# Altium schematic sheet BAT POWER.SchDoc
size A4
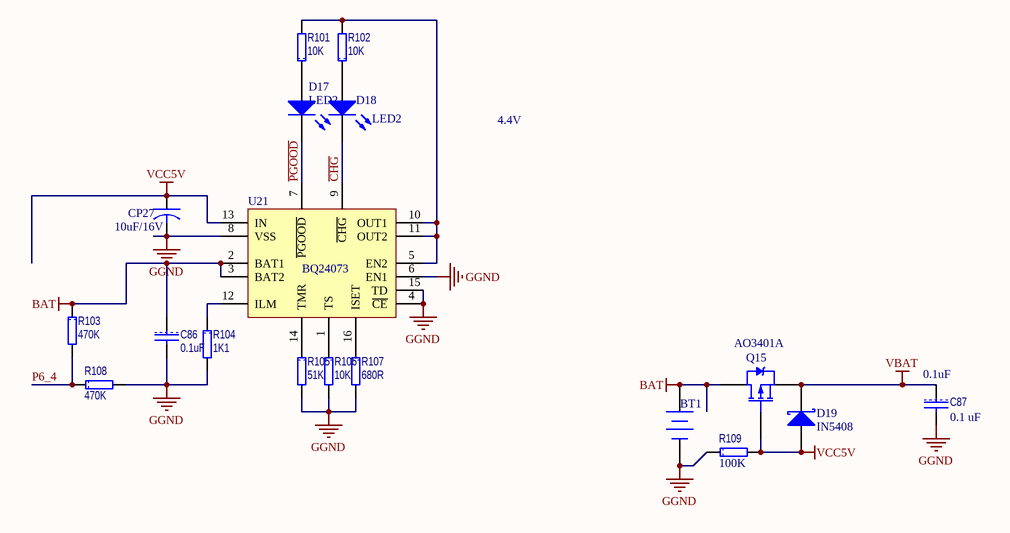
[diagram p0: BAT POWER.SchDoc]

## Parts
BT1  Battery  [BAT-2]  (value not drawn)
C86  0.1uF  [1608[0603]]
C87  value 0.1uF  电容: 0.1 uF  [1608[0603]C]  (hidden comment: C1608X7R1H104K)
CP27  10uF/16V  [3216[1206]]
D17  LED2  [0805LED]
D18  LED2  [0805LED]
D19  IN5408  [DO-214AB/SMC]
Q15  AO3401A  [SOT23_N]
R101  10K  [1608[0603]R]
R102  10K  [1608[0603]R]
R103  470K  [1608[0603]R]
R104  1K1  [1608[0603]R]
R105  51K  [1608[0603]R]
R106  10K  [1608[0603]R]
R107  680R  [1608[0603]R]
R108  470K  [1608[0603]R]
R109  value 100K  [1608[0603]R]  (hidden comment: CRCW0603100KFKEA)
U21  BQ24073  [BQ24073]

## Nets
BAT: BT1.1(+) C86.1 Q15.3(D) R103.1 U21.2(BAT1) U21.3(BAT2)
GGND: BT1.2(-) C86.2 C87.2 CP27.2 R104.2 R105.2 R106.2 R107.2 R108.2 R109.1 U21.4(~{CE}) U21.6(EN1) U21.8(VSS) U21.15(TD)
VBAT: C87.1 D19.2(K) Q15.2(S)
VCC5V: CP27.1 D19.1(A) Q15.1(G) R109.2 U21.13(IN)
~{CHG}: D18.2(K) U21.9(~{CHG})
P6_4: R103.2 R108.1
~{PGOOD}: D17.2(K) U21.7(~{PGOOD})
NetD17_1: D17.1(A) R101.1
NetD18_1: D18.1(A) R102.1
NetR101_2: R101.2 R102.2 U21.5(EN2) U21.10(OUT1) U21.11(OUT2)
NetR104_1: R104.1 U21.12(ILM)
NetR105_1: R105.1 U21.14(TMR)
NetR106_1: R106.1 U21.1(TS)
NetR107_1: R107.1 U21.16(ISET)

## Notes on the sheet
- 4.4V

## Library data of the parts
BT1 = Battery: 插针 Multicell Battery; Published: 24-Mar-1999; LatestRevisionDate: 17-Jul-2002; LatestRevisionNote: Re-released for DXP Platform.; PackageReference: BAT-2; Publisher: Altium Limited
C86 = CAP: Capacitor; Manufacturer: TDK; Type: 无铅电容; Model: C0603X7R1H104K; Value: 0.1uF
C87 = CAP: 多层陶瓷电容器MLCC - SMD/SMT 0603 0.1uF 50volts X7R 10%; Manufacturer: TDK; 尺寸: 0.8 mm W x 1.6 mm L x 0.8 mm H; 工作温度范围: - 55 C to + 125 C; 封装 / 箱体: 0603 (1608 metric); 封装: Reel; 产品: General Type MLCCs; 系列: C; 电压额定值: 50 V; 电容-nF: 100 nF; 电容-pF: 100000 pF; 外壳代码 - in: 0603; 外壳代码 - mm: 1608; 产品种类: Low & Medium Capacitance SMD Ceramic Chip Capacitors; 标准包装数量: 4000; Supplier 1: Mouser; Supplier Part Number 1: 810-C1608X7R1H104K; Manufacturer Part Number: C1608X7R1H104K; RoHS: RoHS Compliant; Description 1: 多层陶瓷电容器MLCC - SMD/SMT 0603 0.1uF 50volts X7R 10%; Category: 多层陶瓷电容器MLCC - SMD/SMT; Stock 1: 224604; Pricing 1: 1=0.160, 50=0.070, 100=0.036, 500=0.019, 1000=0.013, 4000=0.010, 8000=0.009, 12000=0.008, 20000=0.007 (USD); 端接类型: SMD/SMT; 容差: 10 %; 制造商: TDK; 温度系数/代码: X7R; RoHS - 贸泽: Y; Minimum Order Quantity: 1; Reeling: True; ComponentLink1URL: http://www.tdk.com/pdf/general_B11.pdf; ComponentLink1Description: http://www.tdk.com/pdf/general_B11.pdf
CP27 = CAPACITOR: Tantalum Capacitor; 公司: TAJ; name: TAJ-A-106-M-010-R; value: 10uF/16V
D17 D18 = LED2: Typical RED, GREEN, YELLOW, AMBER GaAs LED; Published: 8-Jun-2000; LatestRevisionDate: 17-Jul-2002; LatestRevisionNote: Re-released for DXP Platform.; PackageVersion: Feb-2002; PackageReference: 3.2X1.6X1.1; Publisher: Altium Limited; PackageDescription: SM LED; 2 Flat Leads
D19 = D Schottky: 肖特基二极管与整流器 3.0 Amp 60 Volt; Manufacturer: Vishay Semiconductors; Manufacturer Part Number: SS36-E3/57T; 配置: Single; 工作温度范围: - 55 C to + 150 C; 封装 / 箱体: SMC (DO-214AB); 封装: Reel; 产品: Schottky Rectifiers; 正向连续电流: 3 A; 最大浪涌电流: 100 A; 安装风格: SMD/SMT; 正向电压下降: 0.75 V; 制造商: Vishay; 最大反向漏泄电流: 500 uA; 峰值反向电压: 60 V; 标准包装数量: 850; Supplier 1: Mouser; Supplier Part Number 1: 625-SS36-E3; RoHS: RoHS Compliant By Exemption; Description 1: 肖特基二极管与整流器 3.0 Amp 60 Volt; Category: 肖特基二极管与整流器; Stock 1: 481; Pricing 1: 1=0.280, 10=0.250, 100=0.188, 250=0.154, 500=0.144, 850=0.144, 1000=0.139, 2000=0.131 (USD); 产品种类: Schottky Rectifiers; RoHS - 贸泽: E; Minimum Order Quantity: 1; Reeling: True; ComponentLink1URL: http://www.mouser.com/ds/2/427/88751-106389.pdf; ComponentLink1Description: http://www.mouser.com/ds/2/427/88751-106389.pdf
Q15 = IRLML5103: MOSFET P-CH -30V -4.3A SOT23; Manufacturer: Alpha & Omega Semiconductor Inc; FET Type: MOSFET P-Channel, Metal Oxide; FET Feature: Logic Level Gate, 2.5V Drive; Drain to Source Voltage (Vdss): 30V; Current - Continuous Drain (Id) @ 25° C: 4.3A (Ta); Rds On (Max) @ Id, Vgs: 44 mOhm @ 4.3A, 10V; Vgs(th) (Max) @ Id: 1.3V @ 250μA; Gate Charge (Qg) @ Vgs: 12.2nC @ 4.5V; Input Capacitance (Ciss) @ Vds: 1200pF @ 15V; Power - Max: 1.4W; Supplier 1: Digi-Key; Supplier Part Number 1: 785-1001-6-ND; Manufacturer Part Number: AO3401A; RoHS: RoHS Compliant; Description 1: MOSFET P-CH -30V -4.3A SOT23; Category: Discrete Semiconductor Products; Stock 1: 75922; Pricing 1: 1=0.48, 25=0.2792, 100=0.225, 250=0.162, 500=0.1305, 1000=0.10125 (USD); Packaging: Digi-Reel?; Mounting Type: Surface Mount; Package / Case: TO-236-3, SC-59, SOT-23-3; Supplier Device Package: SOT-23-3; ComponentLink1URL: http://www.aosmd.com/res/data_sheets/AO3401A.pdf; ComponentLink1Description: http://www.aosmd.com/res/data_sheets/AO3401A.pdf
R101 R102 = RES: Model: CRCW060310K0KKEDTR; 公司: vishay; Parameters: 50V 1/10W 0.5%; Type: 无铅电阻; Value: 10K
R103 R108 = RES: Manufacturer: vishay; Model: CRCW0603470K0KKEDTR; Value: 470K; Type: 无铅电阻
R104 = RES: Manufacturer: vishay; Model: RT0603DRD7D1K1L; Parameters: 50V 1/10W 0.5%; Type: 无铅电阻; Value: 1K1
R105 = RES: Manufacturer: vishay; Model: RT0603DRD7D51KL; Parameters: 50V 1/10W 0.5%; Type: 无铅电阻; Value: 51K
R106 = RES: Manufacturer: vishay; Model: CRCW060310K0KKEDTR; Parameters: 50V 1/10W 0.5%; Type: 无铅电阻; Value: 10K
R107 = RES: Manufacturer: vishay; Model: RT0603DRD7D680RL; Parameters: 50V 1/10W 0.5%; Type: 无铅电阻; Value: 680R
R109 = RES: 厚膜电阻器 - SMD 1/10watt 100Kohms 1%; Manufacturer: Vishay / Dale; 尺寸: 0.85 mm W x 1.55 mm L x 0.45 mm H; 工作温度范围: - 55 C to + 155 C; 封装 / 箱体: 0603 (1608 metric); 封装: Reel; 功率额定值: 100 mW; 产品: Thick Film Resistors SMD; 系列: CRCW; 温度系数: 100 PPM / K; 端接类型: SMD/SMT; 电压额定值: 75 V; 制造商: Vishay; 产品种类: 0603 Thick Film Chip Resistors; 标准包装数量: 5000; 外壳代码 - in: 0603; 外壳代码 - mm: 1608; Supplier 1: Mouser; Supplier Part Number 1: 71-CRCW0603-100K-E3; Manufacturer Part Number: CRCW0603100KFKEA; RoHS: RoHS Compliant By Exemption; Category: 厚膜电阻器 - SMD; Stock 1: 175756; Pricing 1: 1=0.080, 10=0.013, 100=0.010, 1000=0.008, 5000=0.005, 25000=0.004, 50000=0.003 (USD); 电阻: 100 kOhms; 容差: 1 %; RoHS - 贸泽: E; Minimum Order Quantity: 1; Reeling: True; ComponentLink1URL: http://www.mouser.com/ds/2/427/dcrcwe3-109170.pdf; ComponentLink1Description: http://www.mouser.com/ds/2/427/dcrcwe3-109170.pdf; Description 1: 厚膜电阻器 - SMD 1/10watt 100Kohms 1%